# EAGLE design Lichtsteuerung (EAGLE 5.11)

## Sheet 1 of 2
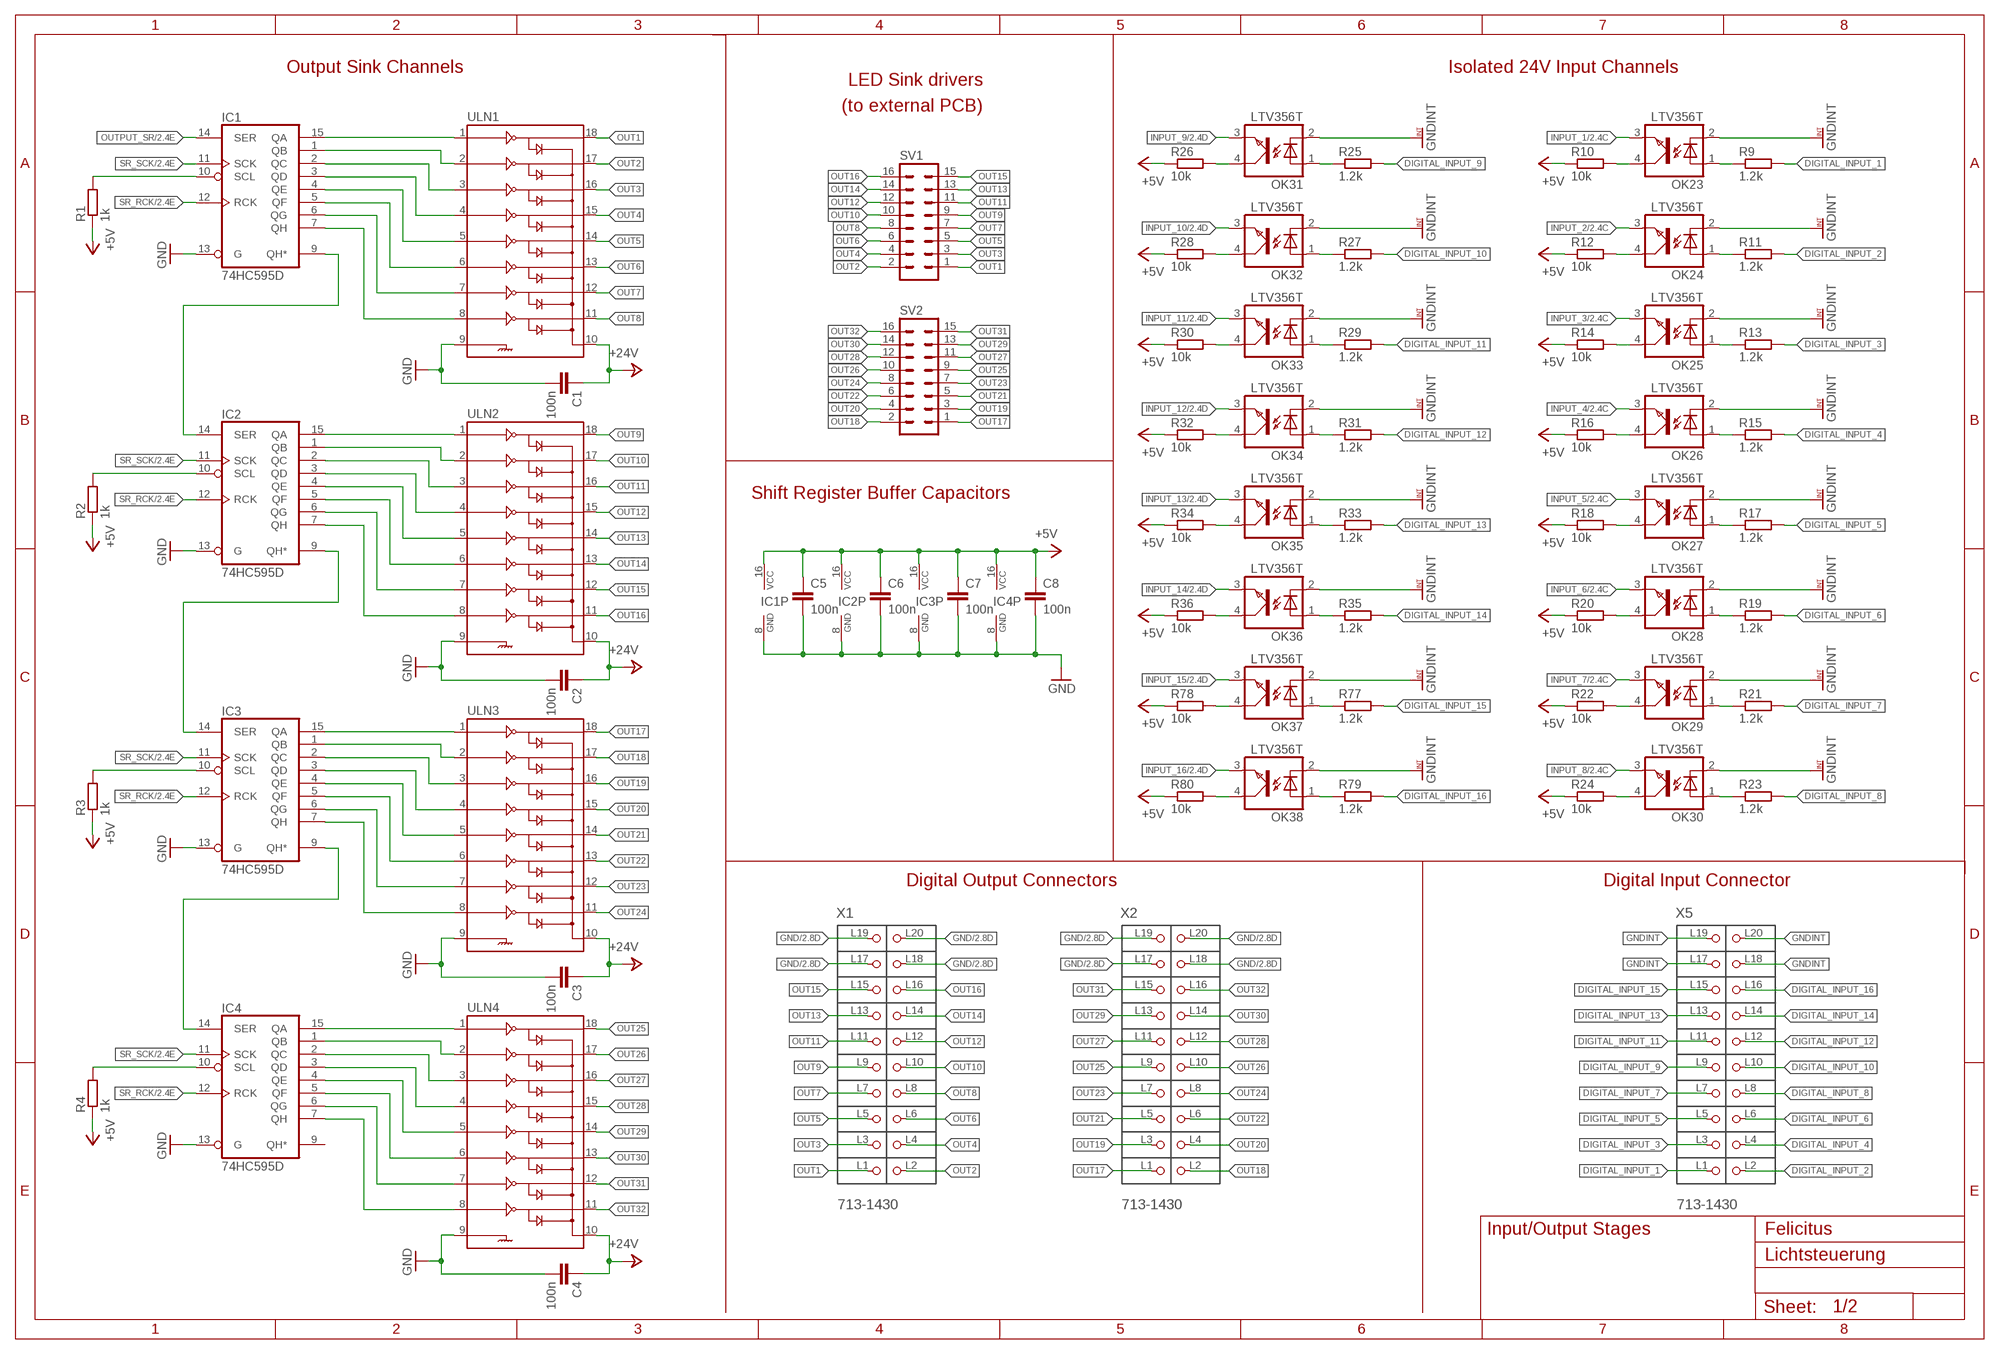
[diagram p0: schematic, sheet 1]

### Parts
C1  100n  C-EUC1206  [C1206]
C2  100n  C-EUC1206  [C1206]
C3  100n  C-EUC1206  [C1206]
C4  100n  C-EUC1206  [C1206]
C5  100n  C-EUC0805  [C0805]
C6  100n  C-EUC0805  [C0805]
C7  100n  C-EUC0805  [C0805]
C8  100n  C-EUC0805  [C0805]
IC1  74HC595D  [SO16]
IC2  74HC595D  [SO16]
IC3  74HC595D  [SO16]
IC4  74HC595D  [SO16]
OK23  LTV356T  LTV816S  [SMD4]
OK24  LTV356T  LTV816S  [SMD4]
OK25  LTV356T  LTV816S  [SMD4]
OK26  LTV356T  LTV816S  [SMD4]
OK27  LTV356T  LTV816S  [SMD4]
OK28  LTV356T  LTV816S  [SMD4]
OK29  LTV356T  LTV816S  [SMD4]
OK30  LTV356T  LTV816S  [SMD4]
OK31  LTV356T  LTV816S  [SMD4]
OK32  LTV356T  LTV816S  [SMD4]
OK33  LTV356T  LTV816S  [SMD4]
OK34  LTV356T  LTV816S  [SMD4]
OK35  LTV356T  LTV816S  [SMD4]
OK36  LTV356T  LTV816S  [SMD4]
OK37  LTV356T  LTV816S  [SMD4]
OK38  LTV356T  LTV816S  [SMD4]
R1  1k  R-EU_R0805  [R0805]
R2  1k  R-EU_R0805  [R0805]
R3  1k  R-EU_R0805  [R0805]
R4  1k  R-EU_R0805  [R0805]
R9  1.2k  R-EU_R0805  [R0805]
R10  10k  R-EU_R0805  [R0805]
R11  1.2k  R-EU_R0805  [R0805]
R12  10k  R-EU_R0805  [R0805]
R13  1.2k  R-EU_R0805  [R0805]
R14  10k  R-EU_R0805  [R0805]
R15  1.2k  R-EU_R0805  [R0805]
R16  10k  R-EU_R0805  [R0805]
R17  1.2k  R-EU_R0805  [R0805]
R18  10k  R-EU_R0805  [R0805]
R19  1.2k  R-EU_R0805  [R0805]
R20  10k  R-EU_R0805  [R0805]
R21  1.2k  R-EU_R0805  [R0805]
R22  10k  R-EU_R0805  [R0805]
R23  1.2k  R-EU_R0805  [R0805]
R24  10k  R-EU_R0805  [R0805]
R25  1.2k  R-EU_R0805  [R0805]
R26  10k  R-EU_R0805  [R0805]
R27  1.2k  R-EU_R0805  [R0805]
R28  10k  R-EU_R0805  [R0805]
R29  1.2k  R-EU_R0805  [R0805]
R30  10k  R-EU_R0805  [R0805]
R31  1.2k  R-EU_R0805  [R0805]
R32  10k  R-EU_R0805  [R0805]
R33  1.2k  R-EU_R0805  [R0805]
R34  10k  R-EU_R0805  [R0805]
R35  1.2k  R-EU_R0805  [R0805]
R36  10k  R-EU_R0805  [R0805]
R77  1.2k  R-EU_R0805  [R0805]
R78  10k  R-EU_R0805  [R0805]
R79  1.2k  R-EU_R0805  [R0805]
R80  10k  R-EU_R0805  [R0805]
SV1  ML16  [ML16]
SV2  ML16  [ML16]
ULN1  ULN2803SOICW  [SO18L]
ULN2  ULN2803SOICW  [SO18L]
ULN3  ULN2803SOICW  [SO18L]
ULN4  ULN2803SOICW  [SO18L]
X1  713-1430  [P-713-1430]
X2  713-1430  [P-713-1430]
X5  713-1430  [P-713-1430]

### Nets
+5V: C5.1 C6.1 C7.1 C8.1 IC1.16(VCC) IC2.16(VCC) IC3.16(VCC) IC4.16(VCC) R1.1 R2.1 R3.1 R4.1 R10.1 R12.1 R14.1 R16.1 R18.1 R20.1 R22.1 R24.1 R26.1 R28.1 R30.1 R32.1 R34.1 R36.1 R78.1 R80.1 ; also sheet 2
+24V [24v-2a]: C1.1 C2.1 C3.1 C4.1 ULN1.10 ULN2.10 ULN3.10 ULN4.10 ; also sheet 2
DIGITAL_INPUT_1: R9.2 X5.L1
DIGITAL_INPUT_2: R11.2 X5.L2
DIGITAL_INPUT_3: R13.2 X5.L3
DIGITAL_INPUT_4: R15.2 X5.L4
DIGITAL_INPUT_5: R17.2 X5.L5
DIGITAL_INPUT_6: R19.2 X5.L6
DIGITAL_INPUT_7: R21.2 X5.L7
DIGITAL_INPUT_8: R23.2 X5.L8
DIGITAL_INPUT_9: R25.2 X5.L9
DIGITAL_INPUT_10: R27.2 X5.L10
DIGITAL_INPUT_11: R29.2 X5.L11
DIGITAL_INPUT_12: R31.2 X5.L12
DIGITAL_INPUT_13: R33.2 X5.L13
DIGITAL_INPUT_14: R35.2 X5.L14
DIGITAL_INPUT_15: R77.2 X5.L15
DIGITAL_INPUT_16: R79.2 X5.L16
GND: C1.2 C2.2 C3.2 C4.2 C5.2 C6.2 C7.2 C8.2 IC1.8(GND) IC1.13(G) IC2.8(GND) IC2.13(G) IC3.8(GND) IC3.13(G) IC4.8(GND) IC4.13(G) ULN1.9 ULN2.9 ULN3.9 ULN4.9 X1.L17 X1.L18 X1.L19 X1.L20 X2.L17 X2.L18 X2.L19 X2.L20 ; also sheet 2
GNDINT: OK23.2(C) OK24.2(C) OK25.2(C) OK26.2(C) OK27.2(C) OK28.2(C) OK29.2(C) OK30.2(C) OK31.2(C) OK32.2(C) OK33.2(C) OK34.2(C) OK35.2(C) OK36.2(C) OK37.2(C) OK38.2(C) X5.L17 X5.L18 X5.L19 X5.L20
INPUT_1: OK23.3(EMIT) ; also sheet 2
INPUT_2: OK24.3(EMIT) ; also sheet 2
INPUT_3: OK25.3(EMIT) ; also sheet 2
INPUT_4: OK26.3(EMIT) ; also sheet 2
INPUT_5: OK27.3(EMIT) ; also sheet 2
INPUT_6: OK28.3(EMIT) ; also sheet 2
INPUT_7: OK29.3(EMIT) ; also sheet 2
INPUT_8: OK30.3(EMIT) ; also sheet 2
INPUT_9: OK31.3(EMIT) ; also sheet 2
INPUT_10: OK32.3(EMIT) ; also sheet 2
INPUT_11: OK33.3(EMIT) ; also sheet 2
INPUT_12: OK34.3(EMIT) ; also sheet 2
INPUT_13: OK35.3(EMIT) ; also sheet 2
INPUT_14: OK36.3(EMIT) ; also sheet 2
INPUT_15: OK37.3(EMIT) ; also sheet 2
INPUT_16: OK38.3(EMIT) ; also sheet 2
N$1: IC1.15(QA) ULN1.1
N$2: IC1.1(QB) ULN1.2
N$3: IC1.2(QC) ULN1.3
N$4: IC1.3(QD) ULN1.4
N$5: IC1.4(QE) ULN1.5
N$6: IC1.5(QF) ULN1.6
N$7: IC1.6(QG) ULN1.7
N$8: IC1.7(QH) ULN1.8
N$9: IC2.15(QA) ULN2.1
N$10: IC2.1(QB) ULN2.2
N$11: IC2.2(QC) ULN2.3
N$12: IC2.3(QD) ULN2.4
N$13: IC2.4(QE) ULN2.5
N$14: IC2.5(QF) ULN2.6
N$15: IC2.6(QG) ULN2.7
N$16: IC2.7(QH) ULN2.8
N$17: IC3.15(QA) ULN3.1
N$18: IC3.1(QB) ULN3.2
N$19: IC3.2(QC) ULN3.3
N$20: IC3.3(QD) ULN3.4
N$21: IC3.4(QE) ULN3.5
N$22: IC3.5(QF) ULN3.6
N$23: IC3.6(QG) ULN3.7
N$24: IC3.7(QH) ULN3.8
N$25: IC4.15(QA) ULN4.1
N$26: IC4.1(QB) ULN4.2
N$27: IC4.2(QC) ULN4.3
N$28: IC4.3(QD) ULN4.4
N$29: IC4.4(QE) ULN4.5
N$30: IC4.5(QF) ULN4.6
N$31: IC4.6(QG) ULN4.7
N$32: IC4.7(QH) ULN4.8
N$33: IC1.9(QH*) IC2.14(SER)
N$34: IC2.9(QH*) IC3.14(SER)
N$35: IC3.9(QH*) IC4.14(SER)
N$36: IC1.10(SCL) R1.2
N$37: IC2.10(SCL) R2.2
N$38: IC3.10(SCL) R3.2
N$39: IC4.10(SCL) R4.2
N$49: OK23.1(A) R9.1
N$50: OK23.4(COL) R10.2
N$51: OK24.1(A) R11.1
N$52: OK24.4(COL) R12.2
N$54: OK25.1(A) R13.1
N$55: OK25.4(COL) R14.2
N$56: OK26.1(A) R15.1
N$57: OK26.4(COL) R16.2
N$58: OK27.1(A) R17.1
N$59: OK27.4(COL) R18.2
N$60: OK28.1(A) R19.1
N$61: OK28.4(COL) R20.2
N$62: OK29.1(A) R21.1
N$63: OK29.4(COL) R22.2
N$64: OK30.1(A) R23.1
N$65: OK30.4(COL) R24.2
N$66: OK31.1(A) R25.1
N$67: OK31.4(COL) R26.2
N$68: OK32.1(A) R27.1
N$69: OK32.4(COL) R28.2
N$70: OK33.1(A) R29.1
N$75: OK33.4(COL) R30.2
N$78: OK34.1(A) R31.1
N$81: OK34.4(COL) R32.2
N$84: OK35.1(A) R33.1
N$87: OK35.4(COL) R34.2
N$90: OK36.1(A) R35.1
N$93: OK36.4(COL) R36.2
N$96: OK37.1(A) R77.1
N$105: OK37.4(COL) R78.2
N$107: OK38.1(A) R79.1
N$108: OK38.4(COL) R80.2
OUT1 [24v-2a]: SV1.1 ULN1.18 X1.L1
OUT2 [24v-2a]: SV1.2 ULN1.17 X1.L2
OUT3 [24v-2a]: SV1.3 ULN1.16 X1.L3
OUT4 [24v-2a]: SV1.4 ULN1.15 X1.L4
OUT5 [24v-2a]: SV1.5 ULN1.14 X1.L5
OUT6 [24v-2a]: SV1.6 ULN1.13 X1.L6
OUT7 [24v-2a]: SV1.7 ULN1.12 X1.L7
OUT8 [24v-2a]: SV1.8 ULN1.11 X1.L8
OUT9 [24v-2a]: SV1.9 ULN2.18 X1.L9
OUT10 [24v-2a]: SV1.10 ULN2.17 X1.L10
OUT11 [24v-2a]: SV1.11 ULN2.16 X1.L11
OUT12 [24v-2a]: SV1.12 ULN2.15 X1.L12
OUT13 [24v-2a]: SV1.13 ULN2.14 X1.L13
OUT14 [24v-2a]: SV1.14 ULN2.13 X1.L14
OUT15 [24v-2a]: SV1.15 ULN2.12 X1.L15
OUT16 [24v-2a]: SV1.16 ULN2.11 X1.L16
OUT17: SV2.1 ULN3.18 X2.L1
OUT18: SV2.2 ULN3.17 X2.L2
OUT19: SV2.3 ULN3.16 X2.L3
OUT20: SV2.4 ULN3.15 X2.L4
OUT21: SV2.5 ULN3.14 X2.L5
OUT22: SV2.6 ULN3.13 X2.L6
OUT23: SV2.7 ULN3.12 X2.L7
OUT24: SV2.8 ULN3.11 X2.L8
OUT25 [24v-2a]: SV2.9 ULN4.18 X2.L9
OUT26 [24v-2a]: SV2.10 ULN4.17 X2.L10
OUT27 [24v-2a]: SV2.11 ULN4.16 X2.L11
OUT28 [24v-2a]: SV2.12 ULN4.15 X2.L12
OUT29 [24v-2a]: SV2.13 ULN4.14 X2.L13
OUT30 [24v-2a]: SV2.14 ULN4.13 X2.L14
OUT31 [24v-2a]: SV2.15 ULN4.12 X2.L15
OUT32 [24v-2a]: SV2.16 ULN4.11 X2.L16
OUTPUT_SR: IC1.14(SER) ; also sheet 2
SR_RCK: IC1.12(RCK) IC2.12(RCK) IC3.12(RCK) IC4.12(RCK) ; also sheet 2
SR_SCK: IC1.11(SCK) IC2.11(SCK) IC3.11(SCK) IC4.11(SCK) ; also sheet 2
Unconnected: IC4.9(QH*)

### Notes on the sheet
- Output Sink Channels | Isolated 24V Input Channels
- LED Sink drivers
- (to external PCB)
- Shift Register Buffer Capacitors
- Digital Output Connectors | Digital Input Connector
- Input/Output Stages | Felicitus

## Sheet 2 of 2
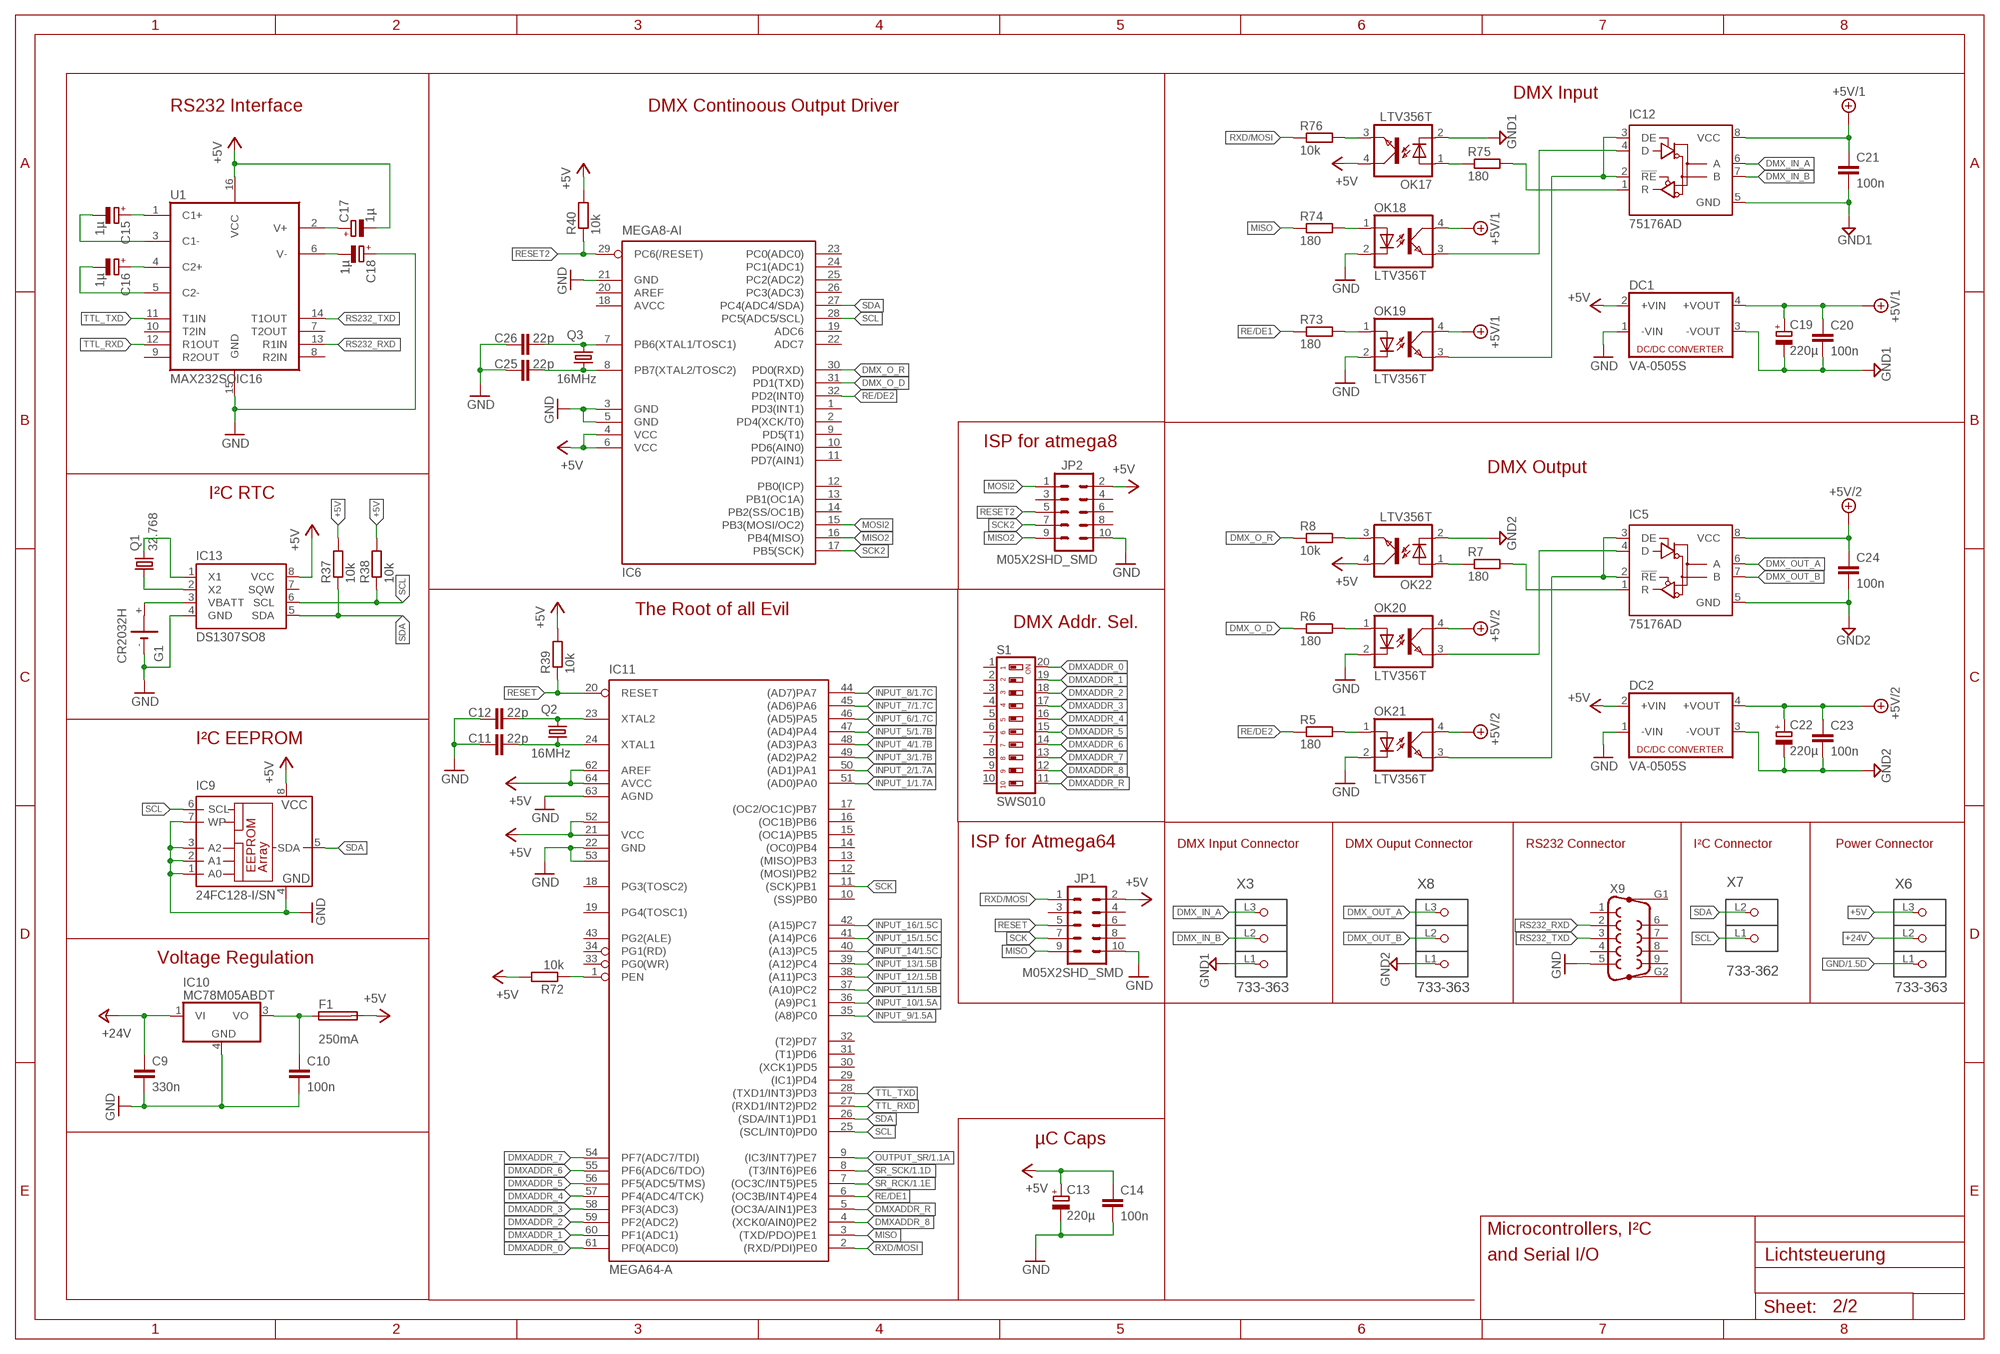
[diagram p1: schematic, sheet 2]

### Parts
C9  330n  C-EUC1206  [C1206]
C10  100n  C-EUC1206  [C1206]
C11  22p  C-EUC0805  [C0805]
C12  22p  C-EUC0805  [C0805]
C13  220µ  CPOL-EU150CLZ-1010  [150CLZ-1010]
C14  100n  C-EUC0805  [C0805]
C15  1µ  CPOL-EU153CLV-0405  [153CLV-0405]
C16  1µ  CPOL-EU153CLV-0405  [153CLV-0405]
C17  1µ  CPOL-EU153CLV-0405  [153CLV-0405]
C18  1µ  CPOL-EU153CLV-0405  [153CLV-0405]
C19  220µ  CPOL-EU150CLZ-1010  [150CLZ-1010]
C20  100n  C-EUC1206  [C1206]
C21  100n  C-EUC0805  [C0805]
C22  220µ  CPOL-EU150CLZ-1010  [150CLZ-1010]
C23  100n  C-EUC1206  [C1206]
C24  100n  C-EUC0805  [C0805]
C25  22p  C-EUC0805  [C0805]
C26  22p  C-EUC0805  [C0805]
DC1  VA-0505S  [4SIL]
DC2  VA-0505S  [4SIL]
F1  250mA  SMD-MICRO-FUSE-BLOCK  [OMNIBLOK]
G1  CR2032H  [CR2032H]
IC5  75176AD  [D_R-PDSO-G8]
IC6  MEGA8-AI  [TQFP32-08]
IC9  24FC128-I/SN  24AA256SN  [SO-08]
IC10  MC78M05ABDT  [DPACK_3]
IC11  MEGA64-A  [TQFP64]
IC12  75176AD  [D_R-PDSO-G8]
IC13  DS1307SO8  [SO08]
JP1  M05X2SHD_SMD  [2X5-SHROUDED_SMD]
JP2  M05X2SHD_SMD  [2X5-SHROUDED_SMD]
OK17  LTV356T  LTV816S  [SMD4]
OK18  LTV356T  LTV816S  [SMD4]
OK19  LTV356T  LTV816S  [SMD4]
OK20  LTV356T  LTV816S  [SMD4]
OK21  LTV356T  LTV816S  [SMD4]
OK22  LTV356T  LTV816S  [SMD4]
Q1  32.768  MC-406  [MC-406]
Q2  16MHz  CRYSTALCTS406  [CTS406]
Q3  16MHz  CRYSTALCTS406  [CTS406]
R5  180  R-EU_R0805  [R0805]
R6  180  R-EU_R0805  [R0805]
R7  180  R-EU_R0805  [R0805]
R8  10k  R-EU_R0805  [R0805]
R37  10k  R-EU_R0805  [R0805]
R38  10k  R-EU_R0805  [R0805]
R39  10k  R-EU_R0805  [R0805]
R40  10k  R-EU_R0805  [R0805]
R72  10k  R-EU_R0805  [R0805]
R73  180  R-EU_R0805  [R0805]
R74  180  R-EU_R0805  [R0805]
R75  180  R-EU_R0805  [R0805]
R76  10k  R-EU_R0805  [R0805]
S1  SWS010  [SMS-010]
U1  MAX232SOIC16  [SO016]
X3  733-363  [P-733-363]
X6  733-363  [P-733-363]
X7  733-362  [P-733-362]
X8  733-363  [P-733-363]
X9  F09VP  [F09VP]

### Nets
+5V: C13.+ C14.1 C17.- DC1.2(+VIN) DC2.2(+VIN) F1.P$2 IC6.4(VCC) IC6.6(VCC) IC9.8(VCC) IC11.21(VCC) IC11.52(VCC1) IC11.62(AREF) IC11.64(AVCC) IC13.8(VCC) JP1.2 JP2.2 OK17.4(COL) OK22.4(COL) R37.2 R38.2 R39.2 R40.2 R72.2 U1.16(VCC) X6.L3(P3) ; also sheet 1
+24V [24v-2a]: C9.1 IC10.1(VI) X6.L2(P2) ; also sheet 1
DMX_IN_A: IC12.6(A) X3.L3(P3)
DMX_IN_B: IC12.7(B) X3.L2(P2)
DMX_O_D: IC6.31(PD1(TXD)) R6.1
DMX_O_R: IC6.30(PD0(RXD)) R8.1
DMX_OUT_A: IC5.6(A) X8.L3(P3)
DMX_OUT_B: IC5.7(B) X8.L2(P2)
DMXADDR_0: IC11.61(PF0(ADC0)) S1.20
DMXADDR_1: IC11.60(PF1(ADC1)) S1.19
DMXADDR_2: IC11.59(PF2(ADC2)) S1.18
DMXADDR_3: IC11.58(PF3(ADC3)) S1.17
DMXADDR_4: IC11.57(PF4(ADC4/TCK)) S1.16
DMXADDR_5: IC11.56(PF5(ADC5/TMS)) S1.15
DMXADDR_6: IC11.55(PF6(ADC6/TDO)) S1.14
DMXADDR_7: IC11.54(PF7(ADC7/TDI)) S1.13
DMXADDR_8: IC11.4((XCK0/AIN0)PE2) S1.12
DMXADDR_R: IC11.5((OC3A/AIN1)PE3) S1.11
GND: C9.2 C10.2 C11.2 C12.2 C13.- C14.2 C18.+ C25.2 C26.2 DC1.1(-VIN) DC2.1(-VIN) G1.- IC6.3(GND) IC6.5(GND) IC6.21(GND) IC9.1(A0) IC9.2(A1) IC9.3(A2) IC9.4(GND) IC9.7(WP) IC10.4(GND) IC11.22(GND) IC11.53(GND1) IC11.63(AGND) IC13.4(GND) JP1.10 JP2.10 OK18.2(C) OK19.2(C) OK20.2(C) OK21.2(C) U1.15(GND) X6.L1(P1) X9.5 ; also sheet 1
GND1: X3.L1(P1)
GND2: X8.L1(P1)
GNDI: C19.- C20.2 C21.2 C22.- C23.2 C24.2 DC1.3(-VOUT) DC2.3(-VOUT) IC5.5(GND) IC12.5(GND) OK17.2(C) OK22.2(C) ; supply symbol labelled GND1, GND2
INPUT_1: IC11.51((AD0)PA0) ; also sheet 1
INPUT_2: IC11.50((AD1)PA1) ; also sheet 1
INPUT_3: IC11.49((AD2)PA2) ; also sheet 1
INPUT_4: IC11.48((AD3)PA3) ; also sheet 1
INPUT_5: IC11.47((AD4)PA4) ; also sheet 1
INPUT_6: IC11.46((AD5)PA5) ; also sheet 1
INPUT_7: IC11.45((AD6)PA6) ; also sheet 1
INPUT_8: IC11.44((AD7)PA7) ; also sheet 1
INPUT_9: IC11.35((A8)PC0) ; also sheet 1
INPUT_10: IC11.36((A9)PC1) ; also sheet 1
INPUT_11: IC11.37((A10)PC2) ; also sheet 1
INPUT_12: IC11.38((A11)PC3) ; also sheet 1
INPUT_13: IC11.39((A12)PC4) ; also sheet 1
INPUT_14: IC11.40((A13)PC5) ; also sheet 1
INPUT_15: IC11.41((A14)PC6) ; also sheet 1
INPUT_16: IC11.42((A15)PC7) ; also sheet 1
MISO: IC11.3((TXD/PDO)PE1) JP1.9 R74.1
MISO2: IC6.16(PB4(MISO)) JP2.9
MOSI2: IC6.15(PB3(MOSI/OC2)) JP2.1
N$40: G1.+ IC13.3(VBATT)
N$41: C11.1 IC11.24(XTAL1) Q2.3
N$42: IC13.2(X2) Q1.1
N$43: IC13.1(X1) Q1.4
N$44: C12.1 IC11.23(XTAL2) Q2.1
N$45: OK22.1(A) R7.1
N$46: OK22.3(EMIT) R8.2
N$47: OK20.1(A) R6.2
N$48: OK21.1(A) R5.2
N$71: C15.+ U1.1(C1+)
N$72: C15.- U1.3(C1-)
N$74: C25.1 IC6.8(PB7(XTAL2/TOSC2)) Q3.3
N$76: C26.1 IC6.7(PB6(XTAL1/TOSC1)) Q3.1
N$97: IC11.1(PEN) R72.1
N$98: C16.+ U1.4(C2+)
N$99: C16.- U1.5(C2-)
N$100: C10.1 F1.P$1 IC10.3(VO)
N$104: OK17.1(A) R75.1
N$106: OK17.3(EMIT) R76.2
N$116: OK18.1(A) R74.2
N$133: OK19.1(A) R73.2
N$156: C18.- U1.6(V-)
N$157: C17.+ U1.2(V+)
OUTPUT_SR: IC11.9((IC3/INT7)PE7) ; also sheet 1
RE/DE1: IC11.6((OC3B/INT4)PE4) R73.1
RE/DE2: IC6.32(PD2(INT0)) R5.1
RE_OUT: IC12.2(!RE) IC12.3(DE) OK19.3(EMIT)
RE_OUT1: IC5.2(!RE) IC5.3(DE) OK21.3(EMIT)
REC$1: IC12.1(R) R75.2
REC$2: IC5.1(R) R7.2
RESET: IC11.20(RESET) JP1.5 R39.1
RESET2: IC6.29(PC6(/RESET)) JP2.5 R40.1
RS232_RXD: U1.13(R1IN) X9.2
RS232_TXD: U1.14(T1OUT) X9.3
RXD/MOSI: IC11.2((RXD/PDI)PE0) JP1.1 R76.1
SCK: IC11.11((SCK)PB1) JP1.7
SCK2: IC6.17(PB5(SCK)) JP2.7
SCL: IC6.28(PC5(ADC5/SCL)) IC9.6(SCL) IC11.25((SCL/INT0)PD0) IC13.6(SCL) R38.1 X7.L1(P1)
SDA: IC6.27(PC4(ADC4/SDA)) IC9.5(SDA) IC11.26((SDA/INT1)PD1) IC13.5(SDA) R37.1 X7.L2(P2)
SR_RCK: IC11.7((OC3C/INT5)PE5) ; also sheet 1
SR_SCK: IC11.8((T3/INT6)PE6) ; also sheet 1
TTL_RXD: IC11.27((RXD1/INT2)PD2) U1.12(R1OUT)
TTL_TXD: IC11.28((TXD1/INT3)PD3) U1.11(T1IN)
TXD_OUT: IC12.4(D) OK18.3(EMIT)
TXD_OUT1: IC5.4(D) OK20.3(EMIT)
VCCIO: C19.+ C20.1 C21.1 C22.+ C23.1 C24.1 DC1.4(+VOUT) DC2.4(+VOUT) IC5.8(VCC) IC12.8(VCC) OK18.4(COL) OK19.4(COL) OK20.4(COL) OK21.4(COL) ; supply symbol labelled +5V/1, +5V/2
Unconnected: G1.+@1(+) IC6.1(PD3(INT1)) IC6.2(PD4(XCK/T0)) IC6.9(PD5(T1)) IC6.10(PD6(AIN0)) IC6.11(PD7(AIN1)) IC6.12(PB0(ICP)) IC6.13(PB1(OC1A)) IC6.14(PB2(SS/OC1B)) IC6.19(ADC6) IC6.20(AREF) IC6.22(ADC7) IC6.23(PC0(ADC0)) IC6.24(PC1(ADC1)) IC6.25(PC2(ADC2)) IC6.26(PC3(ADC3)) IC11.10((SS)PB0) IC11.12((MOSI)PB2) IC11.13((MISO)PB3) IC11.14((OC0)PB4) IC11.15((OC1A)PB5) IC11.16((OC1B)PB6) IC11.17((OC2/OC1C)PB7) IC11.18(PG3(TOSC2)) IC11.19(PG4(TOSC1)) IC11.29((IC1)PD4) IC11.30((XCK1)PD5) IC11.31((T1)PD6) IC11.32((T2)PD7) IC11.33(PG0(WR)) IC11.34(PG1(RD)) IC11.43(PG2(ALE)) IC13.7(SQW) JP1.3 JP1.4 JP1.6 JP1.8 JP2.3 JP2.4 JP2.6 JP2.8 S1.1 S1.2 S1.3 S1.4 S1.5 S1.6 S1.7 S1.8 S1.9 S1.10 U1.7(T2OUT) U1.8(R2IN) U1.9(R2OUT) U1.10(T2IN) X9.1 X9.4 X9.6 X9.7 X9.8 X9.9 X9.G1 X9.G2

### Notes on the sheet
- DMX Input
- RS232 Interface | DMX Continoous Output Driver
- ISP for atmega8
- DMX Output
- I²C RTC
- The Root of all Evil | DMX Addr. Sel.
- I²C EEPROM
- ISP for Atmega64 | DMX Input Connector | DMX Ouput Connector | RS232 Connector | I²C Connector | Power Connector
- Voltage Regulation
- µC Caps
- Microcontrollers, I²C
- and Serial I/O

## Power pins joined to a net without a drawn wire
AVCC: IC6.18(AVCC)

## Library data of the parts
C1-C4 C14 C21 C24 = resistor:C-EU: CAPACITOR, European symbol
C5-C12 C20 C23 C25 C26 = rcl:C-EU: CAPACITOR, European symbol
C13 C15-C19 C22 = rcl:CPOL-EU: POLARIZED CAPACITOR, European symbol
DC1 DC2 = dc-dc-converter:VA-*?: DC DC Converter Single Output, 1 Watt Motien Technology Co.,Ltd. Source: va-serie.pdf; OC_FARNELL: unknown; OC_NEWARK: unknown
F1 = f-lf-omniblok-s:SMD-MICRO-FUSE
G1 = battery:CR2032H: LI BATTERY Varta
IC1-IC4 = 74xx-eu:74*595: 8-bit SHIFT REGISTER, output latch
IC5 IC12 = 751xx:75176A: DIFFERENTIAL BUS TRANSCEIVER Source: http://focus.ti.com/lit/ds/symlink/sn75176a.pdf
IC6 = atmel:MEGA8: MICROCONTROLLER 8 Kbytes FLASH, 1 kbytes SRAM, 512 bytes EEPROM, USART, 6-channel 10 bit ADC, 2-channel 8 bit ADC Pin compatible with Atmega48, ATMega88, ATMega168 Source: avr.lbr; MPN: ATMEGA8-16AU; OC_FARNELL: 9171371; OC_NEWARK: 73M8863
IC9 = microchip:24*: Serial EEPROM I2C; MPN: 24AA256T-I/SM; OC_FARNELL: 1579570; OC_NEWARK: 08N6838
IC10 = linear:MC78M: 500 mA Positive Voltage Regulators Source: Data sheet
IC11 = avr-7:MEGA64: MICROCONTROLLER 64 Kbytes FLASH 4 Kbytes SRAM 2 Kbytes EEPROM DUAL USART 8-channel 10 bit ADC
IC13 = SparkFun:DS1307
JP1 JP2 = SparkFun:M05X2: Header 5x2 Standard 10-pin dual row 0.1" header. Commonly used with AVR-ISP. Use with Spark Fun Electronics SKU: PRT-00778
OK17-OK38 = optocoupler:LTV816: OPTO COUPLER Source: LITEON, LTV816.pdf; OC_FARNELL: unknown; OC_NEWARK: unknown
Q1 = crystal:MC-406: kHz RANGE CRYSTAL UNIT SMD Source: MC-306_405_406_E07X.PDF Homepage; MF: BANNER ENGINEERING CORPORATION; MPN: MQDMC-406; OC_FARNELL: 1216226; OC_NEWARK: 21H2317
Q2 Q3 = crystal:CRYSTAL: CRYSTAL; OC_FARNELL: unknown; OC_NEWARK: unknown
R1-R40 R72-R80 = resistor:R-EU_: RESISTOR, European symbol
S1 = smd-special:SWS010: SMD Dip Switch 10 pol.
SV1 SV2 = con-harting-ml:ML16: HARTING; OC_FARNELL: unknown; OC_NEWARK: unknown
U1 = SparkFun:MAX232: RS232 Transceiver Very common IC. This is generically called 'MAX232', but works with the 3V equivalent MAX3232 generic ICs. Field tested and mother approved. Spark Fun Electronics SKU : COM-00316 (DIP) and COM-00589 (SMD)
ULN1-ULN4 = SparkFun:ULN2803: Darlington Driver ULN2803 Darlington array. 500mA max per channel, 8-channel package. Spark Fun Electronics SKU : COM-00312
X1 X2 X5 = con-wago_3.5mm:713-1430: Serie 713, Stiftleiste (für Leiterplatten) Einlötstift abgewinkelt 0,8 x 0,8 mm / Series 713, Male header (for PCBs) Angled solder pin 0.8 x 0.8 mm Polzahl / Pole No.: 20 Bemessungsspannung / Rated Voltage: 160 V Nennstrom / Nominal Current: 10 A Lötstiftlänge: / Solder Pin Length: 3.8 mm Farbe / Color: schwarz / black Stand: 01.01.2012. Die jeweils aktuellen Daten zu diesem Artikel finden Sie in unserem Produktkatalog, den Sie unter www.wago.com einsehen können. As of: 01/01/2012. Please find the newest data for this article in our product catalogue, which can be viewed under www.wago.com.
X3 X6 X8 = con-wago_2.5mm:733-363: Serie 733, Stiftleiste (für Leiterplatten) Einlötstift abgewinkelt 0,8 x 0,8 mm / Series 733, Male header (for PCBs) Angled solder pin 0.8 x 0.8 mm Polzahl / Pole No.: 3 Rastermaß / Pitch: 2.5 mm Bemessungsspannung / Rated Voltage: 160 V Nennstrom / Nominal Current: 6 A Lötstiftlänge: / Solder Pin Length: 3.7 mm Farbe / Color: lichtgrau / light gray Stand: 01.01.2012. Die jeweils aktuellen Daten zu diesem Artikel finden Sie in unserem Produktkatalog, den Sie unter www.wago.com einsehen können. As of: 01/01/2012. Please find the newest data for this article in our product catalogue, which can be viewed under www.wago.com.
X7 = con-wago_2.5mm:733-362: Serie 733, Stiftleiste (für Leiterplatten) Einlötstift abgewinkelt 0,8 x 0,8 mm / Series 733, Male header (for PCBs) Angled solder pin 0.8 x 0.8 mm Polzahl / Pole No.: 2 Rastermaß / Pitch: 2.5 mm Bemessungsspannung / Rated Voltage: 160 V Nennstrom / Nominal Current: 6 A Lötstiftlänge: / Solder Pin Length: 3.7 mm Farbe / Color: lichtgrau / light gray Stand: 01.01.2012. Die jeweils aktuellen Daten zu diesem Artikel finden Sie in unserem Produktkatalog, den Sie unter www.wago.com einsehen können. As of: 01/01/2012. Please find the newest data for this article in our product catalogue, which can be viewed under www.wago.com.
X9 = con-subd:F09VP: SUB-D; OC_FARNELL: unknown; OC_NEWARK: unknown

## Net classes
1 24v-2a: width 0.508 mm, clearance 0.102 mm
2 24v-500ma: width 0.254 mm, clearance 0.102 mm

## Board
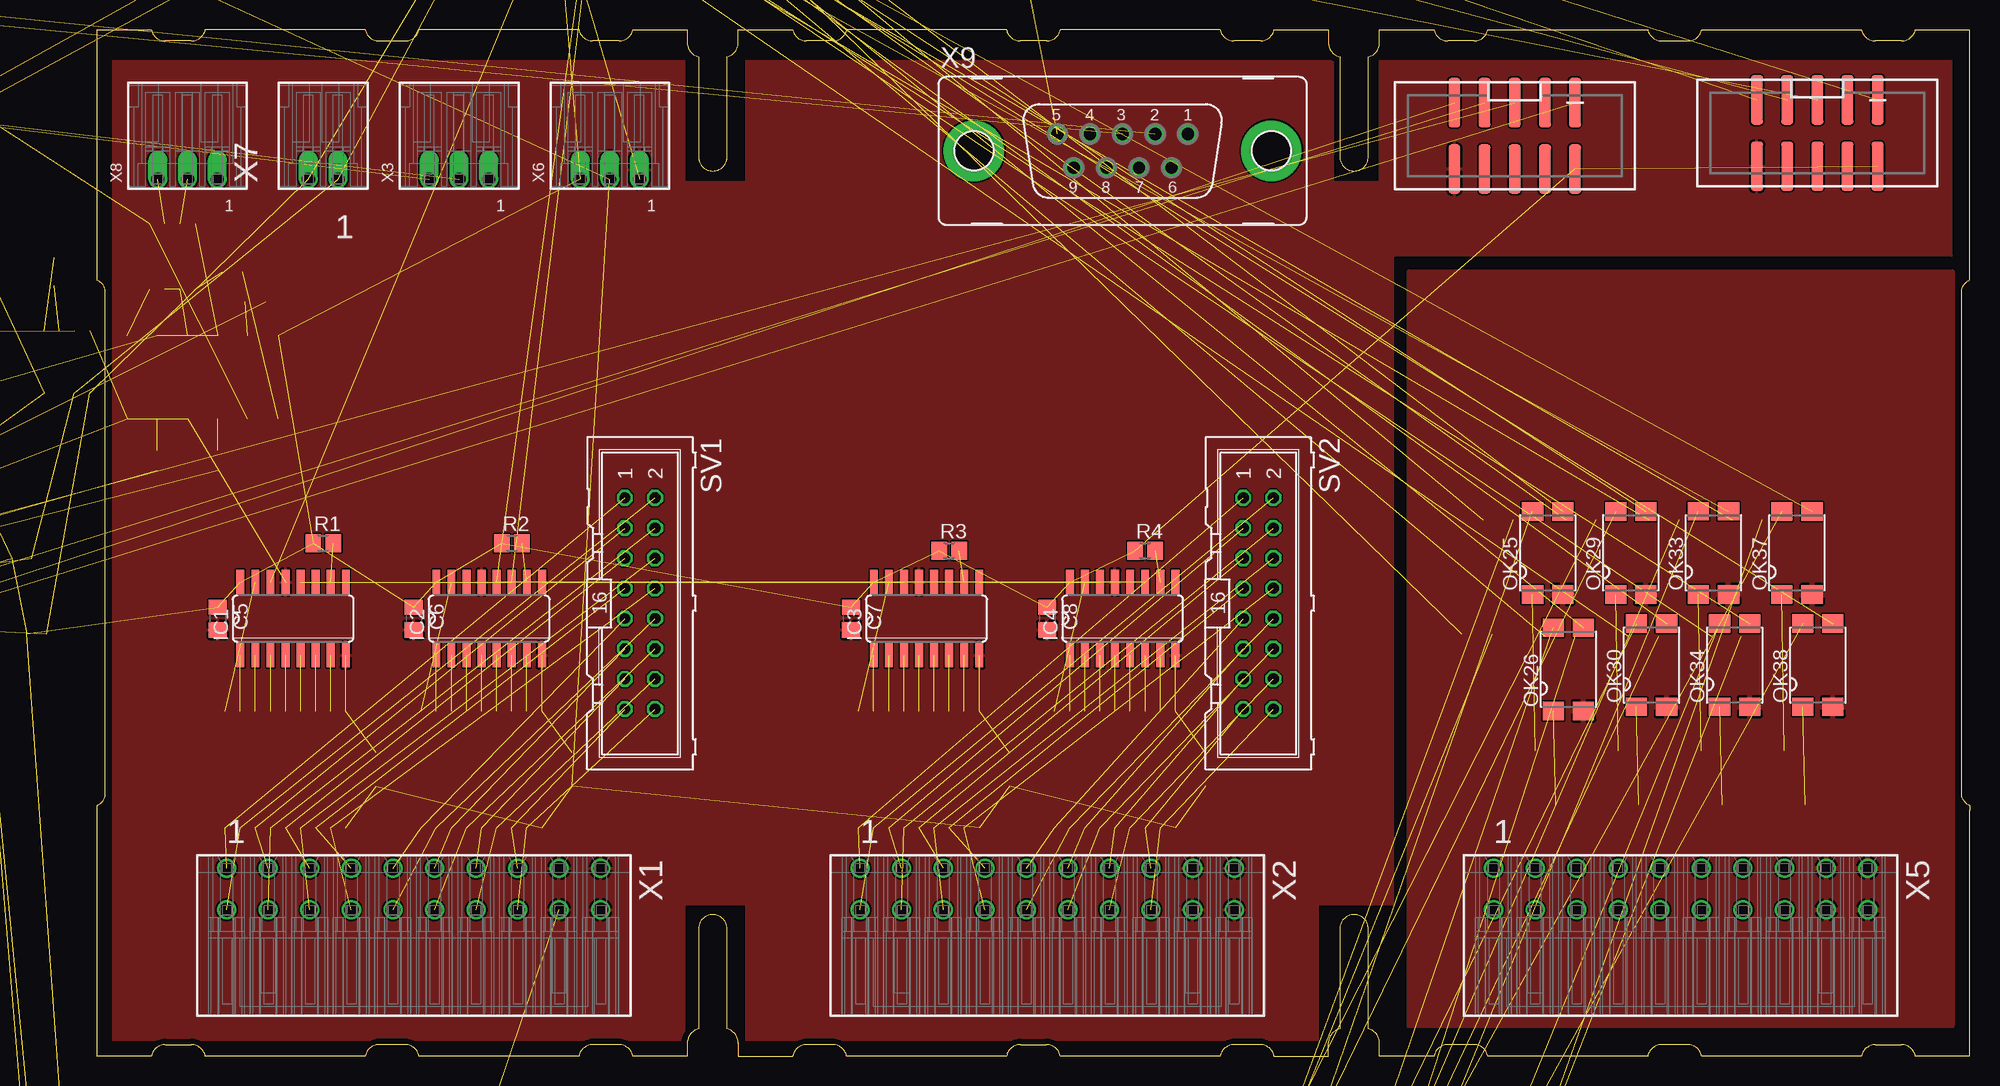
[diagram p2: board, top side]
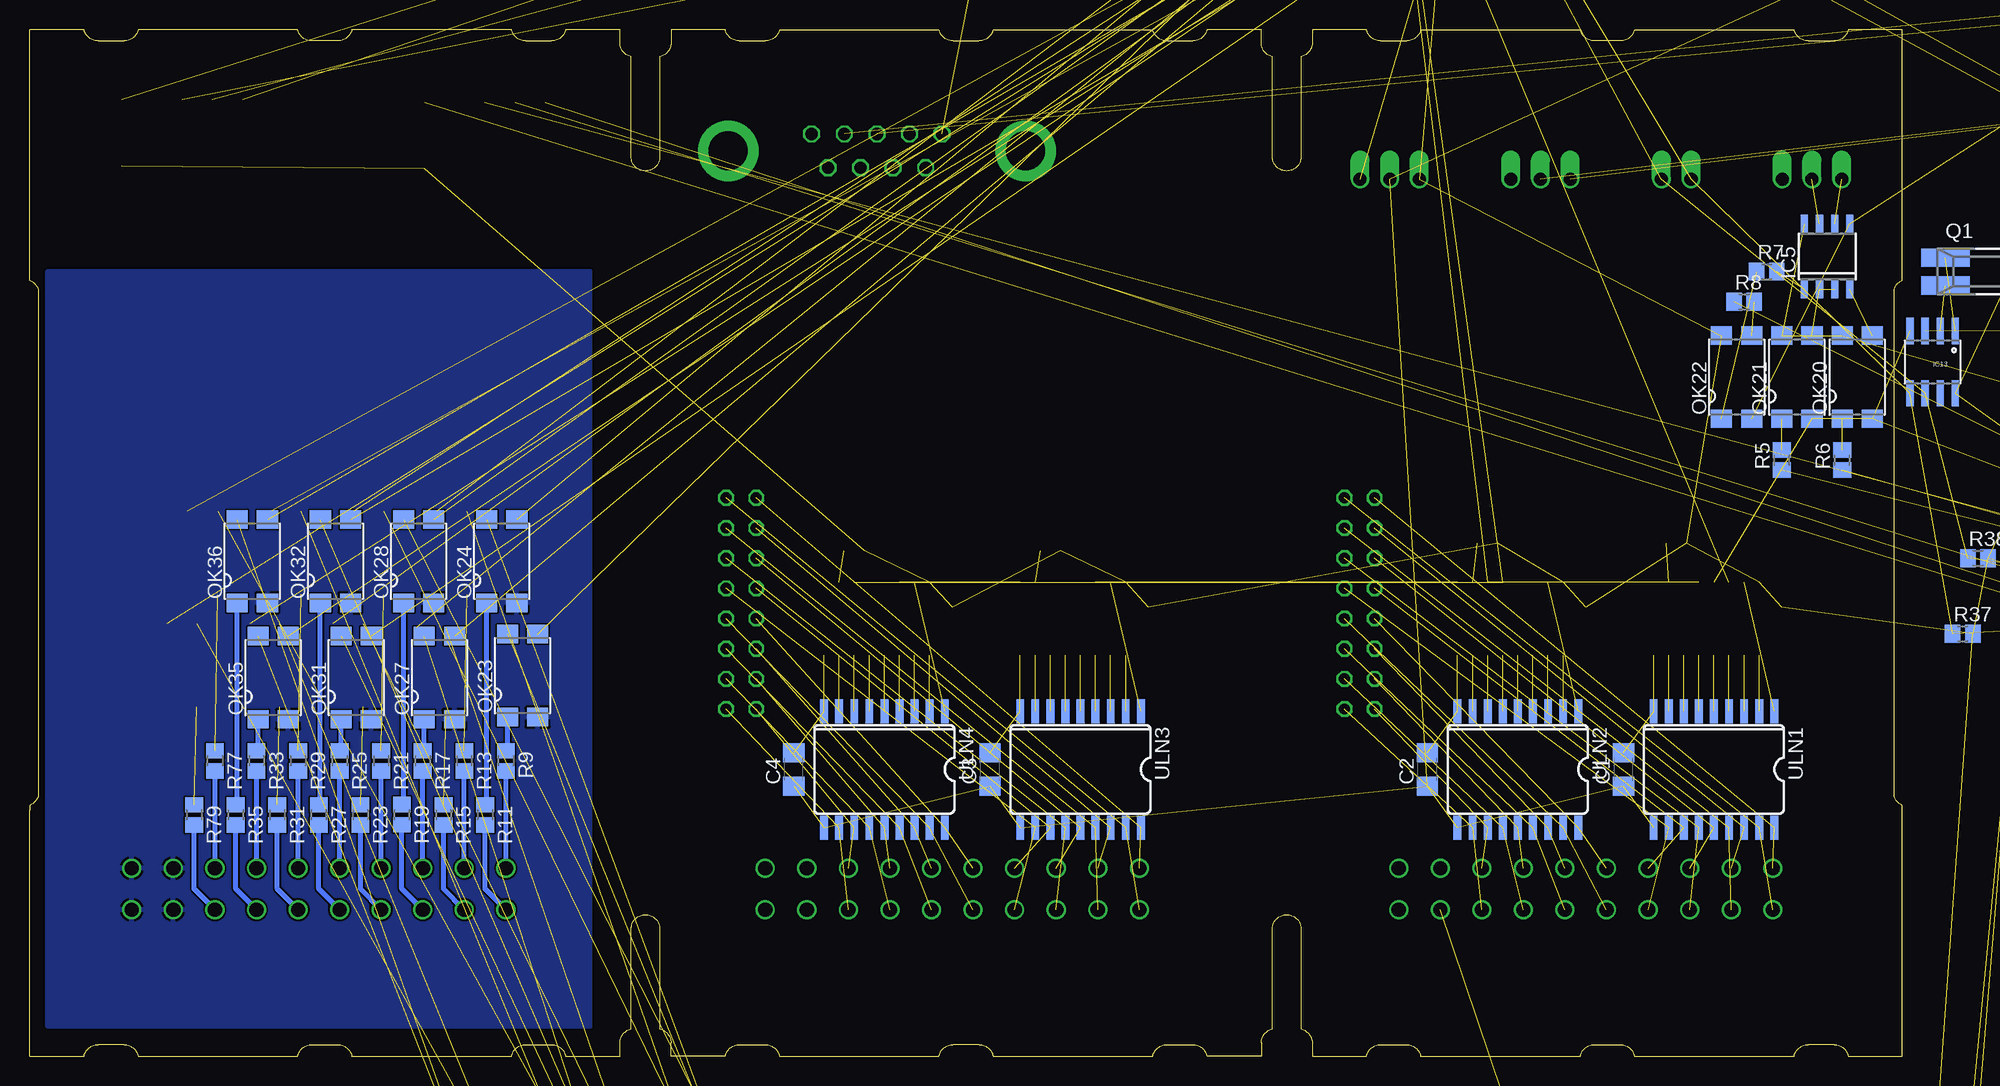
[diagram p3: board, bottom side, seen from below]

Size 157.7 x 86.4 mm. Coordinates in mm from the lower left corner, seen from the top.
Outline: 141 segments
Copper layers (1*16): Top 0.035mm / dielectric 1.5mm / Bottom 0.035mm
Design rules "Aetzwerk-DRC 2 Lagen 35um Cu": minimum track width 6mil, minimum drill 12mil, track to track 6mil, track to pad 6mil, pad to pad 6mil, via to via 6mil, smd to smd 6mil, copper to edge 20mil, drill to drill 8mil, minimum pad ring 8mil, minimum via ring 6mil, stop-mask expansion 3mil, vias tented up to drill 0mil, thermal gap 8mil
tKeepout: 152 lines

### Footprints (pad centres in the part's own frame; a part is rotated, then mirrored left to right if it is on the bottom)
C1206 = smd 1.6 x 1.8: 1 -1.4,0; 2 1.4,0
C0805 = smd 1.3 x 1.5: 1 -0.95,0; 2 0.95,0
150CLZ-1010 = smd 4.3 x 2.5: + 4.15,0; - -4.15,0
C0805' = smd 1.3 x 1.5: 1 -0.85,0; 2 0.85,0
153CLV-0405 = smd 2.6 x 1.6: + 1.8,0; - -1.8,0
4SIL = drill 0.8 round: 1 -3.81,0; 2 -1.27,0; 3 1.27,0; 4 3.81,0
OMNIBLOK = smd 4.7 x 3.8: P$1 -3.4,0; P$2 3.4,0
CR2032H = drill 1.118 pad 2.54 octagon: + 5.08,10.795; +@1 -5.08,10.795; - 0,-6.985
SO16 = smd 0.66 x 2.032: 1 -4.445,-3.073; 2 -3.175,-3.073; 3 -1.905,-3.073; 4 -0.635,-3.073; 5 0.635,-3.073; 6 1.905,-3.073; 7 3.175,-3.073; 8 4.445,-3.073; 9 4.445,3.073; 10 3.175,3.073; 11 1.905,3.073; 12 0.635,3.073; 13 -0.635,3.073; 14 -1.905,3.073; 15 -3.175,3.073; 16 -4.445,3.073
D_R-PDSO-G8 = smd 0.6 x 1.5: 1 -1.905,-2.75; 2 -0.635,-2.75; 3 0.635,-2.75; 4 1.905,-2.75; 5 1.905,2.75; 6 0.635,2.75; 7 -0.635,2.75; 8 -1.905,2.75
TQFP32-08 = smd 1.27 x 0.559: 1 -4.293,2.8; 2 -4.293,2; 3 -4.293,1.2; 4 -4.293,0.4; 5 -4.293,-0.4; 6 -4.293,-1.2; 7 -4.293,-2; 8 -4.293,-2.8; 17 4.293,-2.8; 18 4.293,-2; 19 4.293,-1.2; 20 4.293,-0.4; 21 4.293,0.4; 22 4.293,1.2; 23 4.293,2; 24 4.293,2.8 | smd 0.559 x 1.27: 9 -2.8,-4.293; 10 -2,-4.293; 11 -1.2,-4.293; 12 -0.4,-4.293; 13 0.4,-4.293; 14 1.2,-4.293; 15 2,-4.293; 16 2.8,-4.293; 25 2.8,4.293; 26 2,4.293; 27 1.2,4.293; 28 0.4,4.293; 29 -0.4,4.293; 30 -1.2,4.293; 31 -2,4.293; 32 -2.8,4.293
SO-08 = smd 0.6 x 2.2: 1 -1.905,-2.6; 2 -0.635,-2.6; 3 0.635,-2.6; 4 1.905,-2.6; 5 1.905,2.6; 6 0.635,2.6; 7 -0.635,2.6; 8 -1.905,2.6
DPACK_3 = smd 1 x 1.6: 1 -2.28,-4.8; 3 2.28,-4.8 | smd 5.4 x 6.2: 4 0,2.5
TQFP64 = smd 1.194 x 0.559: 1 -7.76,5.905; 2 -7.76,5.118; 3 -7.76,4.331; 4 -7.76,3.543; 5 -7.76,2.756; 6 -7.76,1.968; 7 -7.76,1.181; 8 -7.76,0.394; 9 -7.76,-0.394; 10 -7.76,-1.181; 11 -7.76,-1.968; 12 -7.76,-2.756; 13 -7.76,-3.543; 14 -7.76,-4.331; 15 -7.76,-5.118; 16 -7.76,-5.905; 33 7.76,-5.905; 34 7.76,-5.118; 35 7.76,-4.331; 36 7.76,-3.543; 37 7.76,-2.756; 38 7.76,-1.968; 39 7.76,-1.181; 40 7.76,-0.394; 41 7.76,0.394; 42 7.76,1.181; 43 7.76,1.968; 44 7.76,2.756; 45 7.76,3.543; 46 7.76,4.331; 47 7.76,5.118; 48 7.76,5.905 | smd 0.559 x 1.194: 17 -5.905,-7.76; 18 -5.118,-7.76; 19 -4.331,-7.76; 20 -3.543,-7.76; 21 -2.756,-7.76; 22 -1.968,-7.76; 23 -1.181,-7.76; 24 -0.394,-7.76; 25 0.394,-7.76; 26 1.181,-7.76; 27 1.968,-7.76; 28 2.756,-7.76; 29 3.543,-7.76; 30 4.331,-7.76; 31 5.118,-7.76; 32 5.905,-7.76; 49 5.905,7.76; 50 5.118,7.76; 51 4.331,7.76; 52 3.543,7.76; 53 2.756,7.76; 54 1.968,7.76; 55 1.181,7.76; 56 0.394,7.76; 57 -0.394,7.76; 58 -1.181,7.76; 59 -1.968,7.76; 60 -2.756,7.76; 61 -3.543,7.76; 62 -4.331,7.76; 63 -5.118,7.76; 64 -5.905,7.76
SO08 = smd 0.61 x 2.21: 1 -1.905,-2.616; 2 -0.635,-2.616; 3 0.635,-2.616; 4 1.905,-2.616; 5 1.905,2.616; 6 0.635,2.616; 7 -0.635,2.616; 8 -1.905,2.616
2X5-SHROUDED_SMD = smd 4.15 x 1: 1 -2.794,5.08; 2 2.794,5.08; 3 -2.794,2.54; 4 2.794,2.54; 5 -2.794,0; 6 2.794,0; 7 -2.794,-2.54; 8 2.794,-2.54; 9 -2.794,-5.08; 10 2.794,-5.08
SMD4 = smd 1.78 x 1.55: 1 -1.27,-3.5; 2 1.27,-3.5; 3 1.27,3.5; 4 -1.27,3.5
MC-406 = smd 4.1 x 1.52: 1 -4,-1.175; 2 4,-1.175; 3 4,1.175; 4 -4,1.175
CTS406 = smd 1.9 x 1.4: 1 -2.2,-1.2; 2 2.2,-1.2; 3 2.2,1.2; 4 -2.2,1.2
R0805 = smd 1.3 x 1.5: 1 -0.85,0; 2 0.85,0
SMS-010 = smd 1.092 x 2.007: 1 -11.43,-4.496; 2 -8.89,-4.496; 3 -6.35,-4.496; 4 -3.81,-4.496; 5 -1.27,-4.496; 6 1.27,-4.496; 7 3.81,-4.496; 8 6.35,-4.496; 9 8.89,-4.496; 10 11.43,-4.496; 11 11.43,4.496; 12 8.89,4.496; 13 6.35,4.496; 14 3.81,4.496; 15 1.27,4.496; 16 -1.27,4.496; 17 -3.81,4.496; 18 -6.35,4.496; 19 -8.89,4.496; 20 -11.43,4.496
ML16 = drill 0.914 octagon: 1 -8.89,-1.27; 2 -8.89,1.27; 3 -6.35,-1.27; 4 -6.35,1.27; 5 -3.81,-1.27; 6 -3.81,1.27; 7 -1.27,-1.27; 8 -1.27,1.27; 9 1.27,-1.27; 10 1.27,1.27; 11 3.81,-1.27; 12 3.81,1.27; 13 6.35,-1.27; 14 6.35,1.27; 15 8.89,-1.27; 16 8.89,1.27
SO016 = smd 0.6 x 1.2: 1 -4.445,-2.8; 2 -3.175,-2.8; 3 -1.905,-2.8; 4 -0.635,-2.8; 5 0.635,-2.8; 6 1.905,-2.8; 7 3.175,-2.8; 8 4.445,-2.8; 9 4.445,2.8; 10 3.175,2.8; 11 1.905,2.8; 12 0.635,2.8; 13 -0.635,2.8; 14 -1.905,2.8; 15 -3.175,2.8; 16 -4.445,2.8
SO18L = smd 0.66 x 2.032: 1 -0.635,-4.902; 2 0.635,-4.902; 3 1.905,-4.902; 4 3.175,-4.902; 5 4.445,-4.902; 6 5.715,-4.902; 7 6.985,-4.902; 8 8.255,-4.902; 9 9.525,-4.902; 10 9.525,4.902; 11 8.255,4.902; 12 6.985,4.902; 13 5.715,4.902; 14 4.445,4.902; 15 3.175,4.902; 16 1.905,4.902; 17 0.635,4.902; 18 -0.635,4.902
P-713-1430 = drill 1.2 round: L1 -5.65,-15.75; L2 -2.15,-15.75; L3 -5.65,-12.25; L4 -2.15,-12.25; L5 -5.65,-8.75; L6 -2.15,-8.75; L7 -5.65,-5.25; L8 -2.15,-5.25; L9 -5.65,-1.75; L10 -2.15,-1.75; L11 -5.65,1.75; L12 -2.15,1.75; L13 -5.65,5.25; L14 -2.15,5.25; L15 -5.65,8.75; L16 -2.15,8.75; L17 -5.65,12.25; L18 -2.15,12.25; L19 -5.65,15.75; L20 -2.15,15.75
P-733-363 = drill 1.1 pad 1.6 offset: L1 -3.65,-2.5; L2 -3.65,0; L3 -3.65,2.5
P-733-362 = drill 1.1 pad 1.6 offset: L1 -3.65,-1.25; L2 -3.65,1.25
F09VP = drill 1.016 octagon: 1 5.486,1.422; 2 2.743,1.422; 3 0,1.422; 4 -2.743,1.422; 5 -5.486,1.422; 6 4.115,-1.422; 7 1.372,-1.422; 8 -1.372,-1.422; 9 -4.115,-1.422 | drill 3.302 pad 5.08 round: G1 -12.522,0; G2 12.522,0

### Placement (x,y rotation side)
C1  23.5,24.13 90 bottom
C2  40.01,24.13 90 bottom
C3  76.84,24.13 90 bottom
C4  93.35,24.13 90 bottom
C5  10.16,36.83 270 top
C6  26.67,36.83 270 top
C7  63.5,36.83 270 top
C8  80.01,36.83 270 top
C9  -68.58,124.46 0 bottom  (outside the outline)
C10  -76.2,115.57 0 bottom  (outside the outline)
C11  -95.25,96.52 180 bottom  (outside the outline)
C12  -91.44,102.87 270 bottom  (outside the outline)
C13  -97.46,114.5 270 top  (outside the outline)
C14  100n  [C0805']  74.3,109.86 90 bottom  (outside the outline)
C15  -120.01,95.25 270 bottom  (outside the outline)
C16  -120.01,102.23 270 bottom  (outside the outline)
C17  -125.09,97.16 270 bottom  (outside the outline)
C18  -125.09,104.14 270 bottom  (outside the outline)
C19  -46.99,120.65 0 top  (outside the outline)
C20  -26.67,71.12 270 bottom  (outside the outline)
C21  100n  [C0805']  1.27,-86.36 0 top  (outside the outline)
C22  21.59,-96.52 0 top  (outside the outline)
C23  12.7,-119.38 0 top  (outside the outline)
C24  100n  [C0805']  20.32,-119.38 0 top  (outside the outline)
C25  -30.48,24.13 180 bottom  (outside the outline)
C26  -40.64,21.59 180 bottom  (outside the outline)
DC1  -11.43,52.07 90 top  (outside the outline)
DC2  5.08,-99.06 0 top  (outside the outline)
F1  -64.77,119.38 0 top  (outside the outline)
G1  -26.41,55.82 90 top  (outside the outline)
IC1  16.51,36.83 0 top
IC2  33.02,36.83 0 top
IC3  69.85,36.83 0 top
IC4  86.36,36.83 0 top
IC5  6.35,67.31 0 bottom
IC6  -39.37,33.02 0 bottom  (outside the outline)
IC9  -102.87,100.33 90 bottom  (outside the outline)
IC10  -78.74,121.92 270 bottom  (outside the outline)
IC11  35.56,109.22 0 bottom  (outside the outline)
IC12  -24.13,77.47 0 bottom  (outside the outline)
IC13  -2.54,58.42 180 bottom
JP1  144.86,77.7 270 top
JP2  119.38,77.47 270 top
OK17  -10.79,75.56 180 bottom  (outside the outline)
OK18  -17.14,69.22 0 bottom  (outside the outline)
OK19  -35.56,69.22 0 bottom  (outside the outline)
OK20  3.81,57.15 0 bottom
OK21  8.89,57.15 0 bottom
OK22  13.97,57.15 0 bottom
OK23  116.2,32.02 0 bottom
OK24  117.95,41.65 0 bottom
OK25  122.15,42.35 0 top
OK26  123.9,32.55 0 top
OK27  123.2,31.85 0 bottom
OK28  124.95,41.65 0 bottom
OK29  129.15,42.35 0 top
OK30  130.9,32.9 0 top
OK31  130.2,31.85 0 bottom
OK32  131.95,41.65 0 bottom
OK33  136.11,42.36 0 top
OK34  137.9,32.9 0 top
OK35  137.2,31.85 0 bottom
OK36  138.95,41.65 0 bottom
OK37  143.15,42.35 0 top
OK38  144.9,32.9 0 top
Q1  -7.62,66.04 0 bottom  (outside the outline)
Q2  -95.25,101.6 270 bottom  (outside the outline)
Q3  -30.48,33.02 180 bottom  (outside the outline)
R1  19.05,43.18 0 top
R2  34.93,43.18 0 top
R3  71.76,42.55 0 top
R4  88.27,42.55 0 top
R5  10.16,50.16 90 bottom
R6  5.08,50.16 90 bottom
R7  11.43,66.04 0 bottom
R8  13.34,63.5 0 bottom
R9  117.6,24.85 270 bottom
R10  24.13,-191.77 0 top  (outside the outline)
R11  119.35,20.3 270 bottom
R12  30.48,-191.77 0 top  (outside the outline)
R13  121.1,24.85 270 bottom
R14  36.83,-191.77 0 top  (outside the outline)
R15  122.85,20.3 270 bottom
R16  43.18,-191.77 0 top  (outside the outline)
R17  124.6,24.85 270 bottom
R18  49.53,-191.77 0 top  (outside the outline)
R19  126.37,20.32 270 bottom
R20  1.27,-199.39 0 top  (outside the outline)
R21  128.1,24.85 270 bottom
R22  7.62,-199.39 0 top  (outside the outline)
R23  129.85,20.3 270 bottom
R24  13.97,-199.39 0 top  (outside the outline)
R25  131.6,24.85 270 bottom
R26  20.32,-199.39 0 top  (outside the outline)
R27  133.35,20.3 270 bottom
R28  26.67,-199.39 0 top  (outside the outline)
R29  135.1,24.85 270 bottom
R30  33.02,-199.39 0 top  (outside the outline)
R31  136.85,20.3 270 bottom
R32  39.37,-199.39 0 top  (outside the outline)
R33  138.6,24.85 270 bottom
R34  45.72,-199.39 0 top  (outside the outline)
R35  140.35,20.3 270 bottom
R36  52.07,-199.39 0 top  (outside the outline)
R37  -5.08,35.56 0 bottom  (outside the outline)
R38  -6.35,41.91 0 bottom  (outside the outline)
R39  -88.9,102.87 270 bottom  (outside the outline)
R40  -17.78,-262.89 0 top  (outside the outline)
R72  -87.5,124.3 90 bottom  (outside the outline)
R73  -172.72,113.03 90 bottom  (outside the outline)
R74  -178.43,113.03 90 bottom  (outside the outline)
R75  18.42,96.52 90 bottom  (outside the outline)
R76  -167,113.03 90 bottom  (outside the outline)
R77  142.1,24.85 270 bottom
R78  1.27,-207.01 0 top  (outside the outline)
R79  143.85,20.3 270 bottom
R80  7.62,-207.01 0 top  (outside the outline)
S1  123.19,123.19 180 top  (outside the outline)
SV1  45.72,38.1 270 top
SV2  97.79,38.1 270 top
U1  -112.72,98.55 90 bottom  (outside the outline)
ULN1  11.43,24.13 180 bottom
ULN2  27.94,24.13 180 bottom
ULN3  64.77,24.13 180 bottom
ULN4  81.28,24.13 180 bottom
X1  26.67,10.16 270 top
X2  80.01,10.16 270 top
X3  30.48,77.47 90 top
X5  133.35,10.16 270 top
X6  43.18,77.47 90 top
X7  19.05,77.47 90 top
X8  7.62,77.47 90 top
X9  86.36,76.2 0 top

### Tracks (layer width: path | path; a pad name or v marks a point on that pad's centre or on a via)
+5V  (52 unrouted)
+24V  (10 unrouted)
DIGITAL_INPUT_1
  Bottom 0.406: X5.L1 R9.2
DIGITAL_INPUT_2
  Bottom 0.406: X5.L2 119.35,14.06 R11.2
DIGITAL_INPUT_3
  Bottom 0.406: X5.L3 R13.2
DIGITAL_INPUT_4
  Bottom 0.406: X5.L4 122.85,14.06 R15.2
DIGITAL_INPUT_5
  Bottom 0.406: X5.L5 R17.2
DIGITAL_INPUT_6
  Bottom 0.406: X5.L6 126.37,14.07 R19.2
DIGITAL_INPUT_7
  Bottom 0.406: X5.L7 R21.2
DIGITAL_INPUT_8
  Bottom 0.406: X5.L8 129.85,14.06 R23.2
DIGITAL_INPUT_9
  Bottom 0.406: X5.L9 R25.2
DIGITAL_INPUT_10
  Bottom 0.406: X5.L10 133.35,14.06 R27.2
DIGITAL_INPUT_11
  Bottom 0.406: X5.L11 R29.2
DIGITAL_INPUT_12
  Bottom 0.406: X5.L12 136.85,14.06 R31.2
DIGITAL_INPUT_13
  Bottom 0.406: X5.L13 R33.2
DIGITAL_INPUT_14
  Bottom 0.406: X5.L14 140.35,14.06 R35.2
DIGITAL_INPUT_15
  Bottom 0.406: X5.L15 R77.2
DIGITAL_INPUT_16
  Bottom 0.406: X5.L16 143.85,14.06 R79.2
DMX_IN_A  (1 unrouted)
DMX_IN_B  (1 unrouted)
DMX_O_D  (1 unrouted)
DMX_O_R  (1 unrouted)
DMX_OUT_A  (1 unrouted)
DMX_OUT_B  (1 unrouted)
DMXADDR_0  (1 unrouted)
DMXADDR_1  (1 unrouted)
DMXADDR_2  (1 unrouted)
DMXADDR_3  (1 unrouted)
DMXADDR_4  (1 unrouted)
DMXADDR_5  (1 unrouted)
DMXADDR_6  (1 unrouted)
DMXADDR_7  (1 unrouted)
DMXADDR_8  (1 unrouted)
DMXADDR_R  (1 unrouted)
GND  (38 unrouted)
  pour Top: 1.27,1.27 1.27,83.82 49.53,83.82 49.53,73.66 54.61,73.66 54.61,83.82 104.14,83.82 104.14,73.66 107.95,73.66 107.95,83.82 156.21,83.82 156.21,67.31 109.22,67.31 109.22,12.7 102.87,12.7 102.87,1.27 54.61,1.27 54.61,12.7 49.53,12.7 49.53,1.27
GNDI  (11 unrouted)
GNDINT
  pour Bottom: 156.21,2.54 110.49,2.54 110.49,66.04 156.21,66.04
  pour Top: 156.21,2.54 110.49,2.54 110.49,66.04 156.21,66.04
INPUT_1  (1 unrouted)
INPUT_2  (1 unrouted)
INPUT_3  (1 unrouted)
INPUT_4  (1 unrouted)
INPUT_5  (1 unrouted)
INPUT_6  (1 unrouted)
INPUT_7  (1 unrouted)
INPUT_8  (1 unrouted)
INPUT_9  (1 unrouted)
INPUT_10  (1 unrouted)
INPUT_11  (1 unrouted)
INPUT_12  (1 unrouted)
INPUT_13  (1 unrouted)
INPUT_14  (1 unrouted)
INPUT_15  (1 unrouted)
INPUT_16  (1 unrouted)
MISO  (2 unrouted)
MISO2  (1 unrouted)
MOSI2  (1 unrouted)
N$1  (1 unrouted)
N$2  (1 unrouted)
N$3  (1 unrouted)
N$4  (1 unrouted)
N$5  (1 unrouted)
N$6  (1 unrouted)
N$7  (1 unrouted)
N$8  (1 unrouted)
N$9  (1 unrouted)
N$10  (1 unrouted)
N$11  (1 unrouted)
N$12  (1 unrouted)
N$13  (1 unrouted)
N$14  (1 unrouted)
N$15  (1 unrouted)
N$16  (1 unrouted)
N$17  (1 unrouted)
N$18  (1 unrouted)
N$19  (1 unrouted)
N$20  (1 unrouted)
N$21  (1 unrouted)
N$22  (1 unrouted)
N$23  (1 unrouted)
N$24  (1 unrouted)
N$25  (1 unrouted)
N$26  (1 unrouted)
N$27  (1 unrouted)
N$28  (1 unrouted)
N$29  (1 unrouted)
N$30  (1 unrouted)
N$31  (1 unrouted)
N$32  (1 unrouted)
N$33  (1 unrouted)
N$34  (1 unrouted)
N$35  (1 unrouted)
N$36  (1 unrouted)
N$37  (1 unrouted)
N$38  (1 unrouted)
N$39  (1 unrouted)
N$40  (1 unrouted)
N$41  (2 unrouted)
N$42  (1 unrouted)
N$43  (1 unrouted)
N$44  (2 unrouted)
N$45  (1 unrouted)
N$46  (1 unrouted)
N$47  (1 unrouted)
N$48  (1 unrouted)
N$49
  Bottom 0.406: R9.1 117.47,25.83 OK23.1
N$50  (1 unrouted)
N$51
  Bottom 0.406: R11.1 119.22,21.28 OK24.1
N$52  (1 unrouted)
N$54  (1 unrouted)
N$55  (1 unrouted)
N$56  (1 unrouted)
N$57  (1 unrouted)
N$58
  Bottom 0.406: R17.1 124.47,25.83 OK27.1
N$59  (1 unrouted)
N$60
  Bottom 0.406: R19.1 126.22,21.32 OK28.1
N$61  (1 unrouted)
N$62  (1 unrouted)
N$63  (1 unrouted)
N$64  (1 unrouted)
N$65  (1 unrouted)
N$66
  Bottom 0.406: R25.1 131.47,25.83 OK31.1
N$67  (1 unrouted)
N$68
  Bottom 0.406: R27.1 133.22,21.28 OK32.1
N$69  (1 unrouted)
N$70  (1 unrouted)
N$71  (1 unrouted)
N$72  (1 unrouted)
N$74  (2 unrouted)
N$75  (1 unrouted)
N$76  (2 unrouted)
N$78  (1 unrouted)
N$81  (1 unrouted)
N$84
  Bottom 0.406: R33.1 138.47,25.83 OK35.1
N$87  (1 unrouted)
N$90
  Bottom 0.406: R35.1 140.22,21.28 OK36.1
N$93  (1 unrouted)
N$96  (1 unrouted)
N$97  (1 unrouted)
N$98  (1 unrouted)
N$99  (1 unrouted)
N$100  (2 unrouted)
N$104  (1 unrouted)
N$105  (1 unrouted)
N$106  (1 unrouted)
N$107  (1 unrouted)
N$108  (1 unrouted)
N$116  (1 unrouted)
N$133  (1 unrouted)
N$156  (1 unrouted)
N$157  (1 unrouted)
OUT1  (2 unrouted)
OUT2  (2 unrouted)
OUT3  (2 unrouted)
OUT4  (2 unrouted)
OUT5  (2 unrouted)
OUT6  (2 unrouted)
OUT7  (2 unrouted)
OUT8  (2 unrouted)
OUT9  (2 unrouted)
OUT10  (2 unrouted)
OUT11  (2 unrouted)
OUT12  (2 unrouted)
OUT13  (2 unrouted)
OUT14  (2 unrouted)
OUT15  (2 unrouted)
OUT16  (2 unrouted)
OUT17  (2 unrouted)
OUT18  (2 unrouted)
OUT19  (2 unrouted)
OUT20  (2 unrouted)
OUT21  (2 unrouted)
OUT22  (2 unrouted)
OUT23  (2 unrouted)
OUT24  (2 unrouted)
OUT25  (2 unrouted)
OUT26  (2 unrouted)
OUT27  (2 unrouted)
OUT28  (2 unrouted)
OUT29  (2 unrouted)
OUT30  (2 unrouted)
OUT31  (2 unrouted)
OUT32  (2 unrouted)
OUTPUT_SR  (1 unrouted)
RE/DE1  (1 unrouted)
RE/DE2  (1 unrouted)
RE_OUT  (2 unrouted)
RE_OUT1  (2 unrouted)
REC$1  (1 unrouted)
REC$2  (1 unrouted)
RESET  (2 unrouted)
RESET2  (2 unrouted)
RS232_RXD  (1 unrouted)
RS232_TXD  (1 unrouted)
RXD/MOSI  (2 unrouted)
SCK  (1 unrouted)
SCK2  (1 unrouted)
SCL  (5 unrouted)
SDA  (5 unrouted)
SR_RCK  (4 unrouted)
SR_SCK  (4 unrouted)
TTL_RXD  (1 unrouted)
TTL_TXD  (1 unrouted)
TXD_OUT  (1 unrouted)
TXD_OUT1  (1 unrouted)
VCCIO  (13 unrouted)